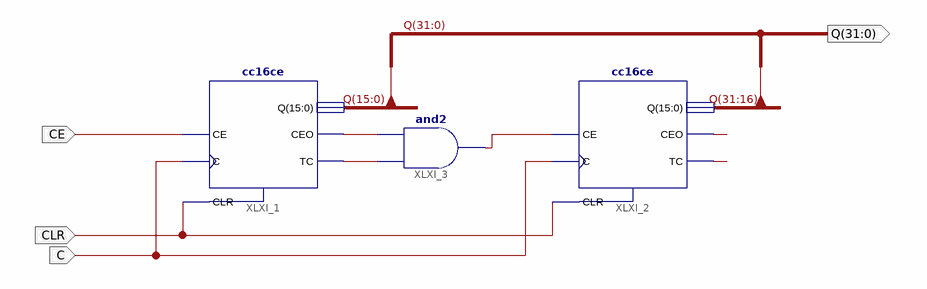
[diagram p0: schematic sheet 1]
// Xilinx ISE schematic b32ce.sch (spartan6) as structural Verilog: 3 symbols, 4 ports
module b32ce (
  input  C,
  input  CLR,
  input  CE,
  output [31:0] Q
);

  wire XLXN_5, XLXN_6, XLXN_7, XLXN_14, XLXN_15;

  cc16ce XLXI_1 (.C(C), .CE(CE), .CLR(CLR), .CEO(XLXN_5), .Q(Q[15:0]), .TC(XLXN_6));
  cc16ce XLXI_2 (.C(C), .CE(XLXN_7), .CLR(CLR), .CEO(XLXN_15), .Q(Q[31:16]), .TC(XLXN_14));
  and XLXI_3 (XLXN_7, XLXN_6, XLXN_5);
endmodule
